# Altium schematic sheet Interfaced board.SchDoc
size 508 x 381 mm
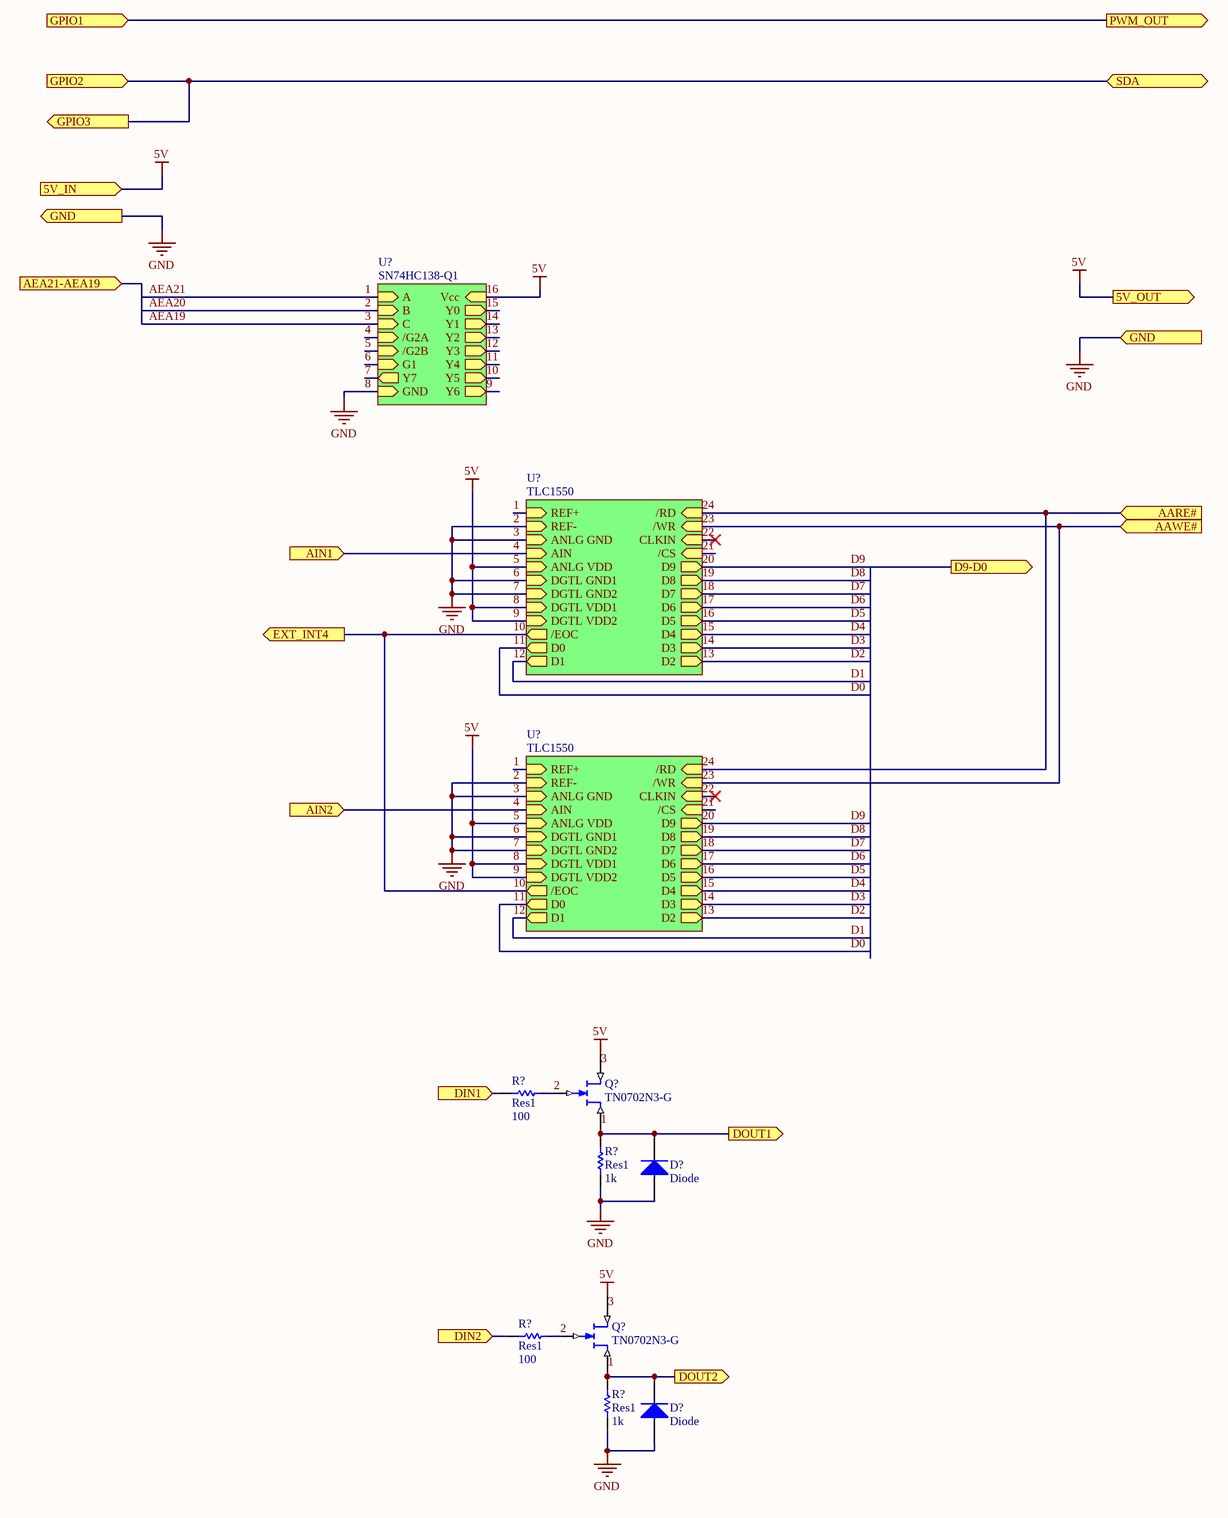
[diagram p0: Interfaced board.SchDoc]

## Parts
(Parts that share a designator on the sheet are numbered #1, #2 ... from top to bottom, then left to right.)
D?#1  Diode  [SMC]
D?#2  Diode  [SMC]
Q?#1  TN0702N3-G  [TO-18]
Q?#2  TN0702N3-G  [TO-18]
R?#1  Res1  value 100  [AXIAL-0.3]
R?#2  Res1  value 1k  [AXIAL-0.3]
R?#3  Res1  value 100  [AXIAL-0.3]
R?#4  Res1  value 1k  [AXIAL-0.3]

## Sub-sheets
SN74HC138-Q1 = File Name: A (in), B (in), Vcc (in), C (in), /G2A (in), /G2B (in), G1 (in), Y7 (out), GND (in), Y0 (out), Y1 (out), Y2 (out), Y3 (out), Y4 (out), Y5 (out), Y6 (out)  | Designator: U?
TLC1550 = ?: REF+ (in), REF- (in), /RD (in), ANLG GND (in), AIN (in), ANLG VDD (in), DGTL GND1 (in), DGTL GND2 (in), DGTL VDD1 (in), DGTL VDD2 (in), /EOC (out), D0 (out), D1 (out), /WR (in), CLKIN (in), /CS (in), D9 (out), D8 (out), D7 (out), D6 (out), D5 (out), D4 (out), D3 (out), D2 (out)  | Designator: U?
TLC1550 = ?: REF+ (in), REF- (in), /RD (in), ANLG GND (in), AIN (in), ANLG VDD (in), DGTL GND1 (in), DGTL GND2 (in), DGTL VDD1 (in), DGTL VDD2 (in), /EOC (out), D0 (out), D1 (out), /WR (in), CLKIN (in), /CS (in), D9 (out), D8 (out), D7 (out), D6 (out), D5 (out), D4 (out), D3 (out), D2 (out)  | Designator: U?

## Ports
5V_IN (in), 5V_OUT (out), AARE# (in), AAWE# (in), AEA21-AEA19 (in), AIN1 (in), AIN2 (in), D9-D0 (out), DIN1 (in), DIN2 (in), DOUT1 (out), DOUT2 (out), EXT_INT4 (out), GND (in), GND (out), GPIO1 (in), GPIO2 (in), GPIO3 (out), PWM_OUT (out), SDA (bidir)

## Nets
16: D?#1.1(A) D?#2.1(A) Q?#1.1(D) Q?#1.2(G) Q?#2.1(D) Q?#2.2(G) R?#1.2 R?#2.1 R?#3.2 R?#4.1 ; port 5V_IN, port GND, port 5V_OUT, sheet SN74HC138-Q1/B, sheet SN74HC138-Q1/Vcc, sheet SN74HC138-Q1/C, sheet SN74HC138-Q1//G2B, sheet SN74HC138-Q1/G1, sheet SN74HC138-Q1/Y7, sheet SN74HC138-Q1/GND, sheet SN74HC138-Q1/Y6, sheet TLC1550/REF-, sheet TLC1550/ANLG GND, sheet TLC1550/ANLG VDD, sheet TLC1550/DGTL GND1, sheet TLC1550/DGTL GND2, sheet TLC1550/DGTL VDD1, sheet TLC1550/DGTL VDD2, sheet TLC1550/D5, sheet TLC1550/REF-, sheet TLC1550/ANLG GND, sheet TLC1550/ANLG VDD, sheet TLC1550/DGTL GND1, sheet TLC1550/DGTL GND2, sheet TLC1550/DGTL VDD1, sheet TLC1550/DGTL VDD2, sheet TLC1550/D5  [also labelled 2, 3, 5, 5V, 6, 7, 8, 9, AEA19, AEA20, D5, GND]
1: sheet SN74HC138-Q1/A, sheet TLC1550/REF+, sheet TLC1550/REF+  [also labelled AEA21]
4: port AIN1, port AIN2, sheet SN74HC138-Q1//G2A, sheet TLC1550/AIN, sheet TLC1550/AIN
10: port EXT_INT4, sheet SN74HC138-Q1/Y5, sheet TLC1550//EOC, sheet TLC1550//EOC
11: sheet SN74HC138-Q1/Y4, sheet TLC1550/D0, sheet TLC1550/D0  [also labelled D0]
12: sheet SN74HC138-Q1/Y3, sheet TLC1550/D1, sheet TLC1550/D1  [also labelled D1]
13: sheet SN74HC138-Q1/Y2, sheet TLC1550/D2, sheet TLC1550/D2  [also labelled D2]
14: sheet SN74HC138-Q1/Y1, sheet TLC1550/D3, sheet TLC1550/D3  [also labelled D3]
15: sheet SN74HC138-Q1/Y0, sheet TLC1550/D4, sheet TLC1550/D4  [also labelled D4]
17: sheet TLC1550/D6, sheet TLC1550/D6  [also labelled D6]
18: sheet TLC1550/D7, sheet TLC1550/D7  [also labelled D7]
19: sheet TLC1550/D8, sheet TLC1550/D8  [also labelled D8]
20: sheet TLC1550/D9, sheet TLC1550/D9  [also labelled D9]
21: sheet TLC1550//CS, sheet TLC1550//CS
22: sheet TLC1550/CLKIN, sheet TLC1550/CLKIN
23: port AAWE#, sheet TLC1550//WR, sheet TLC1550//WR
24: port AARE#, sheet TLC1550//RD, sheet TLC1550//RD
DIN1: R?#1.1 ; port DIN1
DIN2: R?#3.1 ; port DIN2
DOUT1: D?#1.2(K) Q?#1.3(S) R?#2.2 ; port DOUT1
DOUT2: D?#2.2(K) Q?#2.3(S) R?#4.2 ; port DOUT2
GPIO1: port GPIO1, port PWM_OUT
GPIO2: port GPIO2, port SDA, port GPIO3

## Notes on the sheet
- Labels drawn without touching a wire or pin: 1, 3

## Library data of the parts
D?#1 D?#2 = Diode: Default Diode; Published: 8-Jun-2000; LatestRevisionDate: 17-Jul-2002; LatestRevisionNote: Re-released for DXP Platform.; PackageVersion: Sep-1996; PackageReference: SMC; Publisher: Altium Limited; PackageDescription: DO-214-AB/SMC; 2 C-Bend Leads; Body 7.9 x 5.9 mm, inc. leads (LxW); Code_JEDEC: DO-214-AB
Q?#1 Q?#2 = MESFET-N: N-Channel MESFET; Published: 8-Jun-2000; LatestRevisionDate: 17-Jul-2002; LatestRevisionNote: Re-released for DXP Platform.; PackageReference: TO-18; Publisher: Altium Limited; PackageDescription: Can; 3 Leads; Pin Circle Dia. 2.54 mm; Lead Dia. 0.48 mm (max); Code_JEDEC: TO-18
R?#1-R?#4 = Res1: Resistor; Published: 8-Jun-2000; LatestRevisionDate: 17-Jul-2002; LatestRevisionNote: Re-released for DXP Platform.; PackageReference: AXIAL-0.3; Publisher: Altium Limited; PackageDescription: Axial Device, Thru-Hole; 2 Leads; 0.3 in Pin Spacing